# Altium schematic sheet 多合一红外工具.SchDoc
size A2
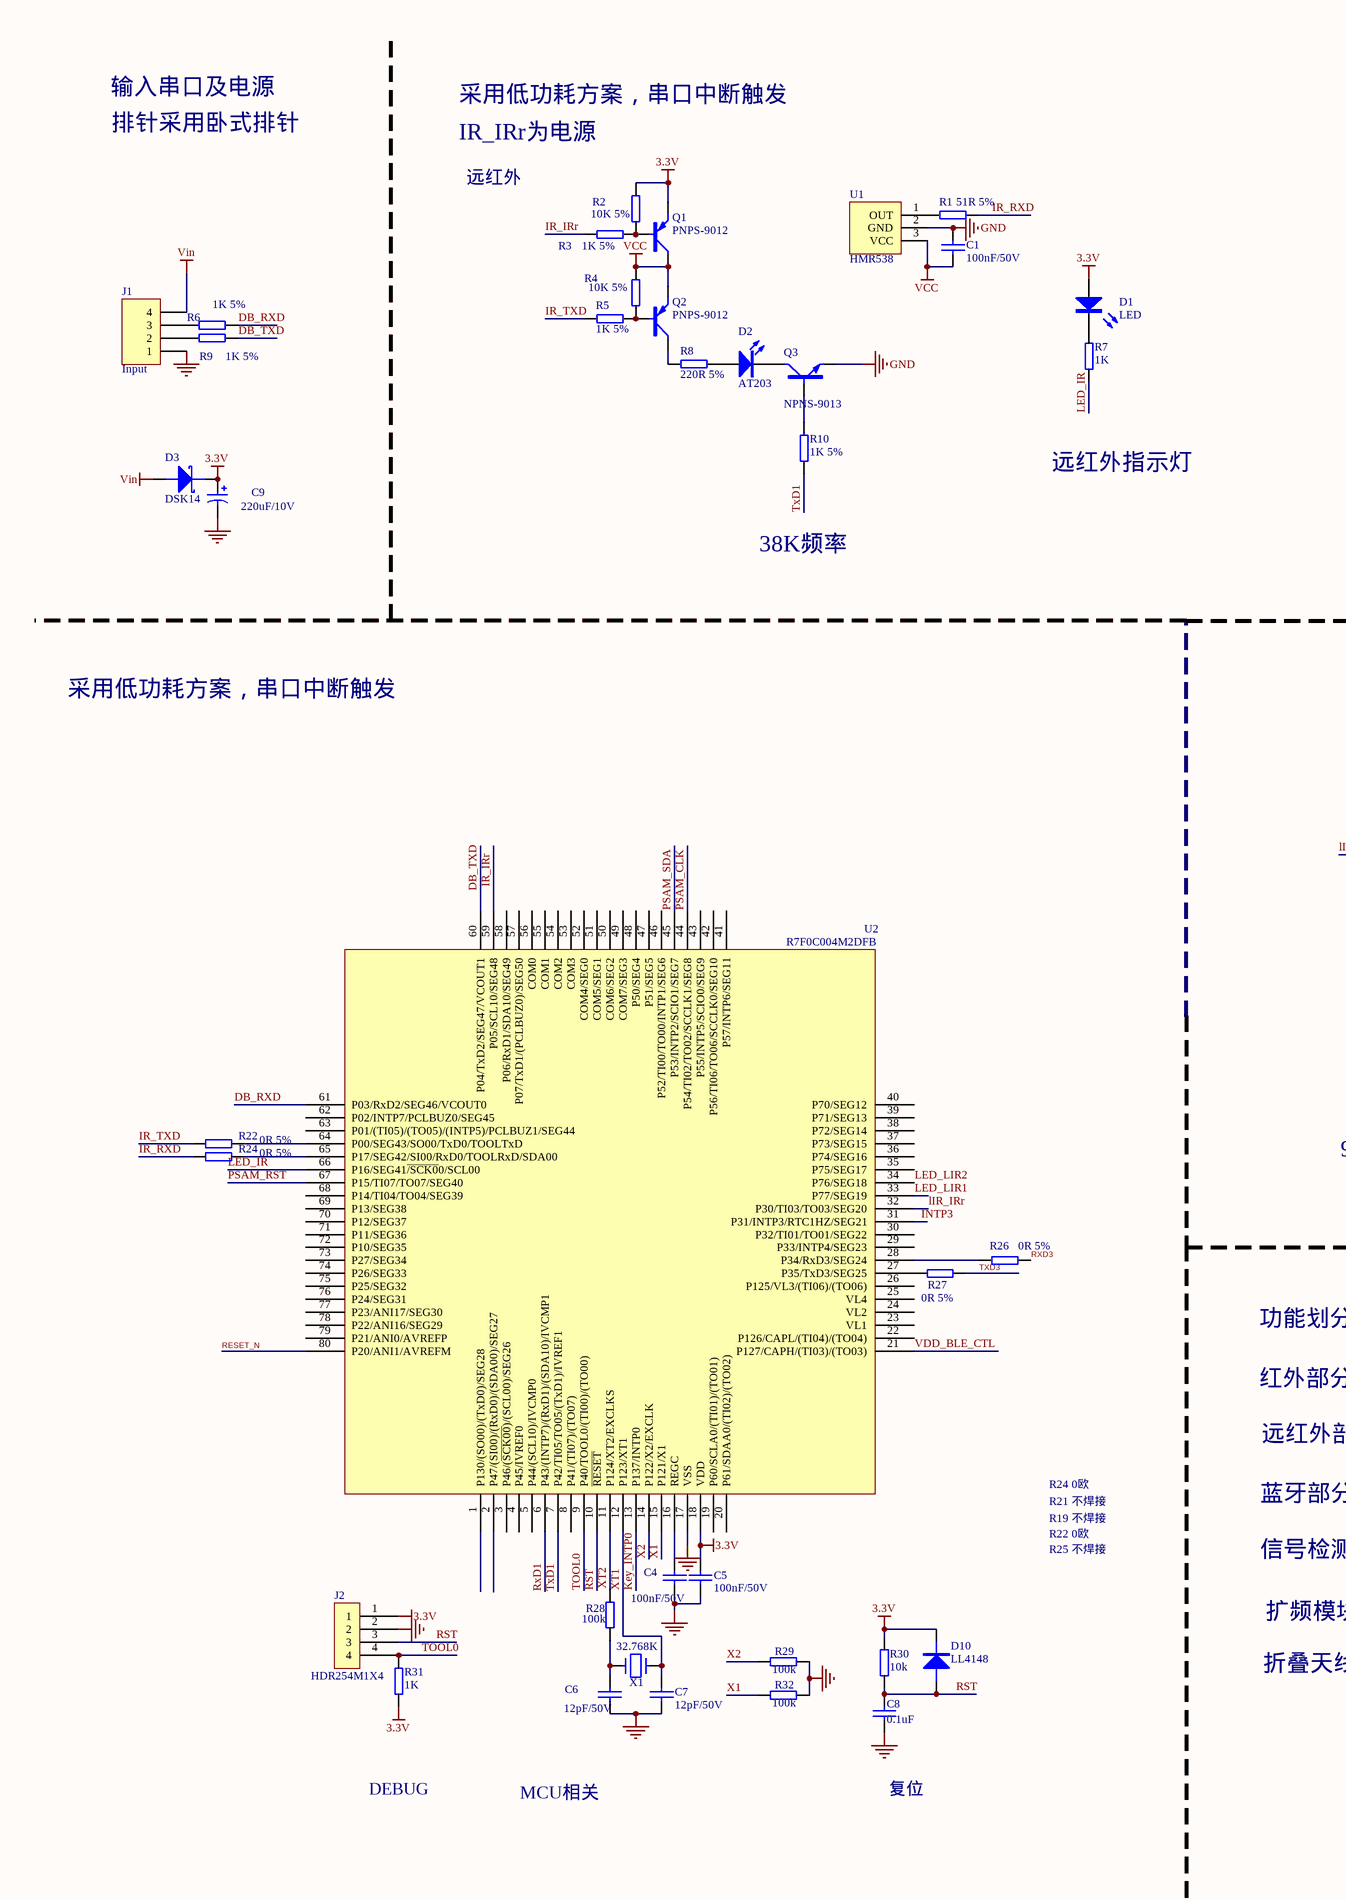
[diagram p0: 多合一红外工具.SchDoc, left]
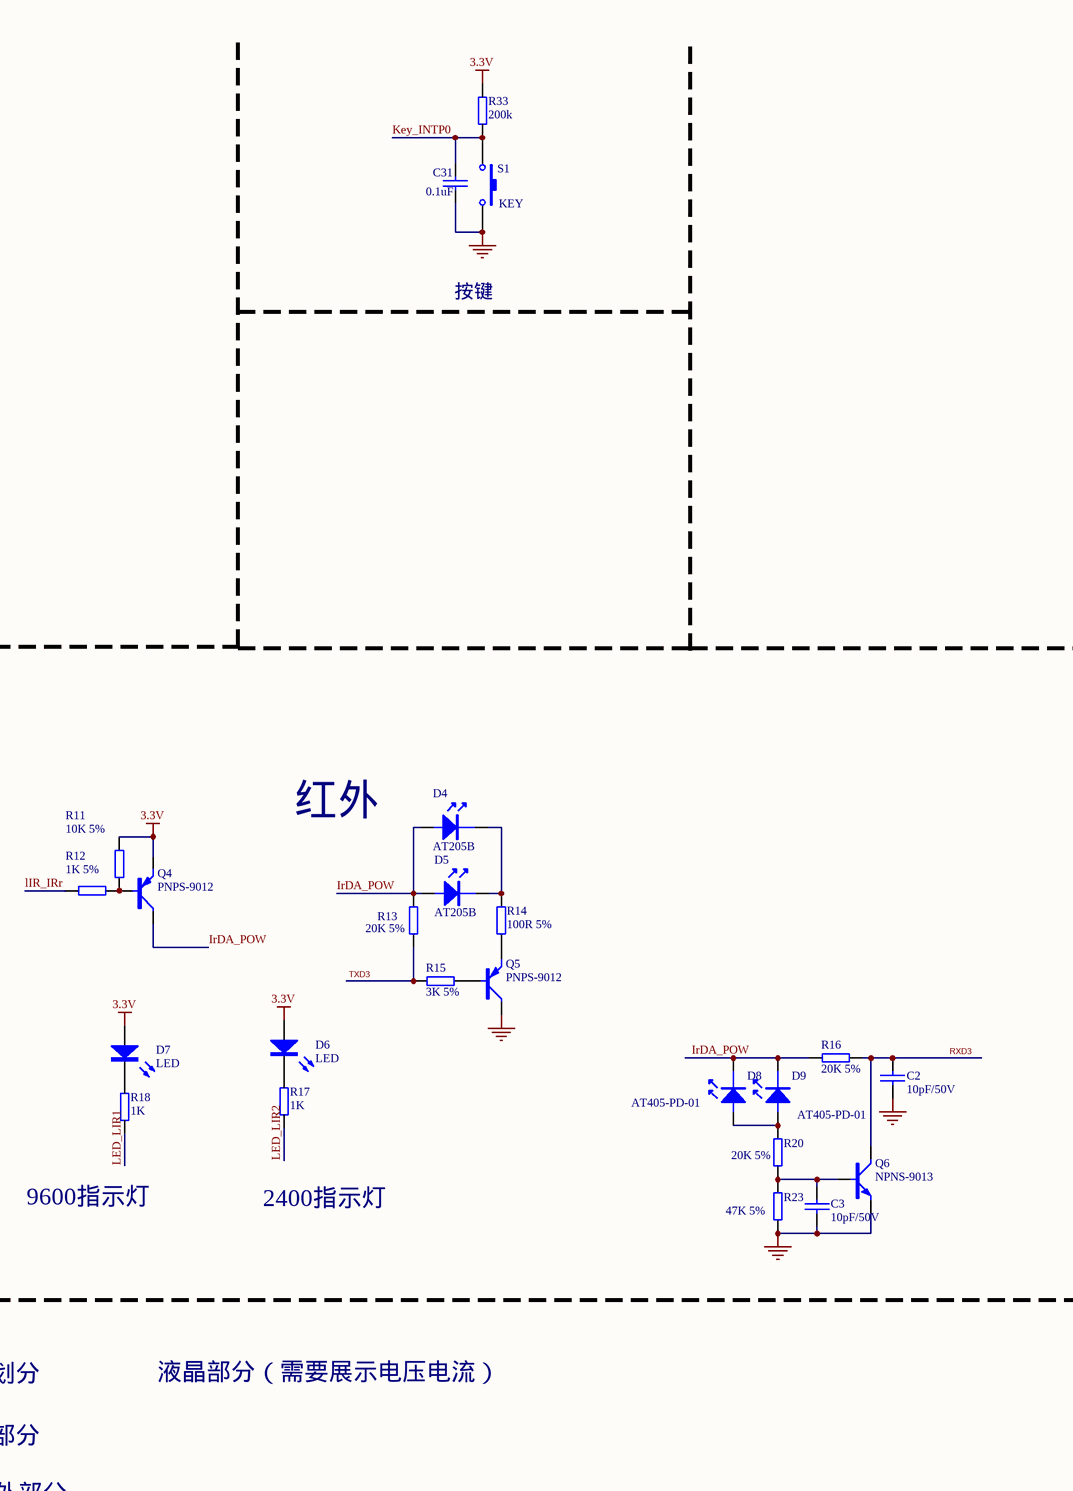
[diagram p1: 多合一红外工具.SchDoc, right]

## Parts
C1  100nF/50V  [CAP0603]
C2  10pF/50V  [CAP0603]
C3  10pF/50V  [CAP0603]
C4  100nF/50V  [CAP0603]
C5  100nF/50V  [CAP0603]
C6  12pF/50V  [CAP0603]
C7  12pF/50V  [CAP0603]
C8  0.1uF  [C0603]
C9  220uF/10V  [CAT7343]
C31  0.1uF  [C0603]
D1  LED  [LED2_300]
D2  AT203  [IR_254_532_300]
D3  DSK14  [SOD-123FL]
D4  AT205B  [IR_254_1000_500]
D5  AT205B  [IR_254_1000_500]
D6  LED  [LED2_300]
D7  LED  [LED2_300]
D8  AT405-PD-01  [IR_254_1000_500]
D9  AT405-PD-01  [IR_254_1000_500]
D10  LL4148  [SOD-123FL]
J1  Input  [HDR1X4]
J2  HDR254M1X4  [HDR1X4]
Q1  PNPS-9012  [SOT-23]
Q2  PNPS-9012  [SOT-23]
Q3  NPNS-9013  [SOT-23]
Q4  PNPS-9012  [SOT-23]
Q5  PNPS-9012  [SOT-23]
Q6  NPNS-9013  [SOT-23]
R1  51R 5%  [RES0603]
R2  10K 5%  [RES0603]
R3  1K 5%  [RES0603]
R4  10K 5%  [RES0603]
R5  1K 5%  [RES0603]
R6  1K 5%  [RES0603]
R7  1K  [R0603]
R8  220R 5%  [RES0603]
R9  1K 5%  [RES0603]
R10  1K 5%  [RES0603]
R11  10K 5%  [RES0603]
R12  1K 5%  [RES0603]
R13  20K 5%  [RES0603]
R14  100R 5%  [RES0603]
R15  3K 5%  [RES0603]
R16  20K 5%  [RES0603]
R17  1K  [R0603]
R18  1K  [R0603]
R20  20K 5%  [RES0603]
R22  0R 5%  [RES0603]
R23  47K 5%  [RES0603]
R24  0R 5%  [RES0603]
R26  0R 5%  [RES0603]
R27  0R 5%  [RES0603]
R28  100k  [R0603]
R29  100k  [R0603]
R30  10k  [R0603]
R31  1K  [R0603]
R32  100k  [R0603]
R33  200k  [R0603]
S1  KEY  [KEY-6*6]
U1  HMR538  [HM538R1]
U2  R7F0C004M2DFB  [LQFP80]
X1  32.768K  [XTAL-2S]

## Nets
3.3V: C5.2 C9.1 D1.1 D3.2 D6.1 D7.1 D10.2 J2.1 Q1.2(E) Q4.2(E) R2.2 R11.2 R30.2 R31.1 R33.2 U2.18(VDD)
GND: C1.1 C2.2 C3.2 C4.2 C5.1 C6.2 C7.2 C8.1 C9.2 C31.1 J1.1 J2.2 Q3.2(E) Q5.3(C) Q6.2(E) R23.1 R29.1 R32.1 S1.2 U1.2(GND) U2.17(VSS)
VCC: C1.2 Q1.3(C) Q2.2(E) R4.2 U1.3(VCC)
Vin: D3.1 J1.4
DB_RXD: R6.2 U2.61(P03/RxD2/SEG46/VCOUT0)
DB_TXD: R9.2 U2.60(P04/TxD2/SEG47/VCOUT1)
INTP3: U2.31(P31/INTP3/RTC1HZ/SEG21)
IR_IRr: R3.1 U2.59(P05/SCL10/SEG48)
IR_RXD: R1.2 R24.1
IR_TXD: R5.1 R22.1
IrDA_POW: D4.1 D5.1 D8.2 D9.2 Q4.3(C) R13.2 R16.1
Key_INTP0: C31.2 R33.1 S1.1 U2.13(P137/INTP0)
LED_IR: R7.1 U2.66(P16/SEG41~{/SCK0}0/SCL00)
LED_LIR1: R18.1 U2.33(P77/SEG19)
LED_LIR2: R17.1 U2.34(P76/SEG18)
lIR_IRr: R12.1 U2.32(P30/TI03/TO03/SEG20)
PSAM_CLK: U2.44(P54/TI02/TO02/SCCLK1/SEG8)
PSAM_RST: U2.67(P15/TI07/TO07/SEG40)
PSAM_SDA: U2.45(P53/INTP2/SCIO1/SEG7)
RESET_N: U2.80(P20/ANI1/AVREFM)
RST: C8.2 D10.1 J2.3 R30.1 U2.10(~{RESET})
RxD1: U2.6(P43/(INTP7)/(RxD1)/(SDA10)/IVCMP1)
RXD3: C2.1 Q6.3(C) R16.2 R26.2
TOOL0: J2.4 R31.2 U2.9(P40/TOOL0/(TI00)/(TO00))
TxD1: R10.2 U2.7(P42/TI05/TO05/(TxD1)/IVREF1)
TXD3: R13.1 R15.1 R27.2
VDD_BLE_CTL: U2.21(P127/CAPH/(TI03)/(TO03))
X1: R32.2 U2.15(P121/X1)
X2: R29.2 U2.14(P122/X2/EXCLK)
XT1: C7.1 U2.12(P123/XT1) X1.1
XT2: R28.2 U2.11(P124/XT2/EXCLKS)
NetC3_1: C3.1 Q6.1(B) R20.1 R23.2
NetC4_1: C4.1 U2.16(REGC)
NetC6_1: C6.1 R28.1 X1.2
NetD1_2: D1.2 R7.2
NetD2_1: D2.1(A) R8.2
NetD2_2: D2.2(K) Q3.3(C)
NetD4_2: D4.2 D5.2 R14.2
NetD6_2: D6.2 R17.2
NetD7_2: D7.2 R18.2
NetD8_1: D8.1 D9.1 R20.2
NetJ1_2: J1.2 R9.1
NetJ1_3: J1.3 R6.1
NetQ1_1: Q1.1(B) R2.1 R3.2
NetQ2_1: Q2.1(B) R4.1 R5.2
NetQ2_3: Q2.3(C) R8.1
NetQ3_1: Q3.1(B) R10.1
NetQ4_1: Q4.1(B) R11.1 R12.2
NetQ5_1: Q5.1(B) R15.2
NetQ5_2: Q5.2(E) R14.1
NetR1_1: R1.1 U1.1(OUT)
NetR22_2: R22.2 U2.64(P00/SEG43/SO00/TxD0/TOOLTxD)
NetR24_2: R24.2 U2.65(P17/SEG42/SI00/RxD0/TOOLRxD/SDA00)
NetR26_1: R26.1 U2.28(P34/RxD3/SEG24)
NetR27_1: R27.1 U2.27(P35/TxD3/SEG25)

Not connected (* = marked no-connect by the designer): U2 1(P130/(SO00)/(TxD0)/SEG28) 2(P47/(SI00)/(RxD0)/(SDA00)/SEG27) 3(P46/(~{SCK00})/(SCL00)/SEG26) 4(P45/IVREF0) 5(P44/(SCL10)/IVCMP0) 8(P41/(TI07)/(TO07)) 19(P60/SCLA0/(TI01)/(TO01)) 20(P61/SDAA0/(TI02)/(TO02)) 22(P126/CAPL/(TI04)/(TO04)) 23(VL1) 24(VL2) 25(VL4) 26(P125/VL3/(TI06)/(TO06)) 29(P33/INTP4/SEG23) 30(P32/TI01/TO01/SEG22) 35(P75/SEG17) 36(P74/SEG16) 37(P73/SEG15) 38(P72/SEG14) 39(P71/SEG13) 40(P70/SEG12) 41(P57/INTP6/SEG11) 42(P56/TI06/TO06/SCCLK0/SEG10) 43(P55/INTP5/SCIO0/SEG9) 46(P52/TI00/TO00/INTP1/SEG6) 47(P51/SEG5) 48(P50/SEG4) 49(COM7/SEG3) 50(COM6/SEG2) 51(COM5/SEG1) 52(COM4/SEG0) 53(COM3) 54(COM2) 55(COM1) 56(COM0) 57(P07/TxD1/(PCLBUZ0)/SEG50) 58(P06/RxD1/SDA10/SEG49) 62(P02/INTP7/PCLBUZ0/SEG45) 63(P01/(TI05)/(TO05)/(INTP5)/PCLBUZ1/SEG44) 68(P14/TI04/TO04/SEG39) 69(P13/SEG38) 70(P12/SEG37) 71(P11/SEG36) 72(P10/SEG35) 73(P27/SEG34) 74(P26/SEG33) 75(P25/SEG32) 76(P24/SEG31) 77(P23/ANI17/SEG30) 78(P22/ANI16/SEG29) 79(P21/ANI0/AVREFP)

## Notes on the sheet
- 输入串口及电源
- 采用低功耗方案，串口中断触发
- 排针采用卧式排针
- IR_IRr为电源
- 远红外
- 按键
- 远红外指示灯
- 38K频率
- 红外
- 9600指示灯
- 2400指示灯
- 功能划分
- 液晶部分（需要展示电压电流）
- 红外部分
- 远红外部分
- R24 0欧
- R21 不焊接
- R19 不焊接
- R22 0欧
- 蓝牙部分
- R25 不焊接
- 信号检测部分
- 折叠天线部分
- 扩频模块部分
- DEBUG
- MCU相关
- 复位

## Library data of the parts
C1 C4 C5 = 101020103-0021: 104pF,50 V,±10%,0603,国巨,CC0603KRX7R9BB104; Part Name: 0603贴片电容; ID: 3; SMD/DIP: SMD; Part Number: 101020103-0021
C2 C3 = 101020103-0014: 10pF,50 V,±5%,0603,X7R,国巨,CC0603JRNPO9BN100; Part Name: 0603贴片电容; ID: 7; SMD/DIP: SMD; Part Number: 101020103-0014
C6 C7 = 101020103-0005: 12P,50 V,±5%,0603,国巨,CC0603JRNPO9BN12; Part Name: 0603贴片电容; ID: 11; SMD/DIP: SMD; Part Number: 101020103-0005
C8 C31 = CAP: 无极性电容
C9 = 1010205-0001: 220uF,10 V,±10%,7343,AVX/ KEMET,T491D227K010AT; Part Name: 7343贴片钽电容; ID: 15; SMD/DIP: SMD; Part Number: 1010205-0001
D1 D6 D7 = 101040102-0001: 圆形插件,3mm 圆形,插件,红光,湖北匡通电子有限公司,3BB4HC; Part Name: 发光二极管; ID: 6; SMD/DIP: DIP; Part Number: 101040102-0001
D2 = 101040102-0010: DIP-2,φ3,插件,红光,上海品观电子有限公司/可得,AT203; Part Name: 红外发射管; ID: 1; SMD/DIP: DIP; Part Number: 101040102-0010
D3 = 101040101-0043: DSK14,SOD-123FL,1 A,40 V,28 V,台湾强茂集团苏州群鑫电子,DSK14; Part Name: 二极管; ID: 10; SMD/DIP: SMD; Part Number: 101040101-0043
D4 D5 = 101040101-0034: 直插,Φ5.8mm圆头透明色，,0.1 A,4 V,5 V,上海品观电子有限公司,AT205B; Part Name: 红外发射管; ID: 2; SMD/DIP: DIP; Part Number: 101040101-0034
D8 D9 = 101040101-0035: Φ5.8mm圆头黑色，光电接收管,Φ5.8mm,0.01 A,1.2 V,60 V,上海品观电子,AT405-PD-01; Part Name: 光敏二极管; ID: 4; SMD/DIP: DIP; Part Number: 101040101-0035
D10 = 101040101-0005: 4148,4148,0.2 A,1 V,100 V,先科,LL4148; Part Name: 贴片二极管; Text Field1: 010101020002; Text Field2: 10; ID: 11; SMD/DIP: SMD; Part Number: 101040101-0005
J1 = Header 4: Header, 4-Pin
J2 = HDR254M1X4: Value: 1K; Published: 8-Jun-2000; LatestRevisionDate: 04-Mar-2005; LatestRevisionNote: PCB Footprint replaced.; PackageReference: J1-0603; Publisher: Altium Limited
Q1 Q2 Q4 Q5 = 101040201-0001: 9012,PNP,SOT-23,JCET;长电,S9012; Part Name: 贴片三极管; ID: 17; SMD/DIP: SMD; Part Number: 101040201-0001
Q3 Q6 = 101040201-0002: 9013,NPN,SOT-23,长电,S9013; Part Name: 贴片三极管; ID: 15; SMD/DIP: SMD; Part Number: 101040201-0002
R1 = 101010103-0037: 国巨,±5%,0603,,155 ℃,-55 ℃,RC0603JR-0751RL,无铅,100 ppm/℃,1/10W,,51欧; Part Name: 0603贴片电阻; ID: 29; SMD/DIP: SMD; Part Number: 101010103-0037
R2 R4 R11 = 101010103-0003: 国巨,±5%,0603,,155 ℃,-55 ℃,RC0603JR-0710KL,无铅,200 ppm/℃,1/10W,,10K; Part Name: 0603贴片电阻; ID: 7; SMD/DIP: SMD; Part Number: 101010103-0003
R3 R5 R6 R9 R10 R12 = 101010103-0008: 1K,±5%,1/10W,0603,国巨,RC0603JR-071KL; Part Name: 0603贴片电阻; ID: 10; SMD/DIP: SMD; Part Number: 101010103-0008
R7 R17 R18 R28-R33 = RES
R8 = 101010103-0019: 220±5%,1/10W,0603,国巨,RC0603JR-07220RL; Part Name: 0603贴片电阻; ID: 16; SMD/DIP: SMD; Part Number: 101010103-0019
R13 R16 R20 = 101010103-0004: 国巨,±5%,0603,,155 ℃,-55 ℃,RC0603JR-0720KL,无铅,200 ppm/℃,1/10W,,20K; Part Name: 0603贴片电阻; ID: 15; SMD/DIP: SMD; Part Number: 101010103-0004
R14 = 101010103-0022: 100R,±5%,1/10W,0603,国巨,RC0603JR-07100RL; Part Name: 0603贴片电阻; ID: 5; SMD/DIP: SMD; Part Number: 101010103-0022
R15 = 101010103-0006: 国巨,±5%,0603,,155 ℃,-55 ℃,RC0603JR-073KL,无铅,100 ppm/℃,1/10W,,3K; Part Name: 0603贴片电阻; ID: 23; SMD/DIP: SMD; Part Number: 101010103-0006
R22 R24 R26 R27 = 101010103-0001: 国巨,±5%,0603,,155 ℃,-55 ℃,RC0603J2-070RL,无铅,200 ppm/℃,1/10W,,0R; Part Name: 0603贴片电阻; ID: 1; SMD/DIP: SMD; Part Number: 101010103-0001
R23 = 101010103-0012: 47K,±5%,1/10W,0603,国巨,RC0603JR-0747KL; Part Name: 0603贴片电阻; ID: 26; SMD/DIP: SMD; Part Number: 101010103-0012
S1 = SW-PB: Switch
U2 = 1010502-0046: LQFP80,贴片,瑞萨,R7F0C004M2DFB; Part Name: MCU处理器; ID: 19; SMD/DIP: SMD; Part Number: 1010502-0046
X1 = XTAL1: 晶振,2PIN